# EasyEDA Pro project ProProject_Mini-Cube_2024-04-10.epro, board PCB3
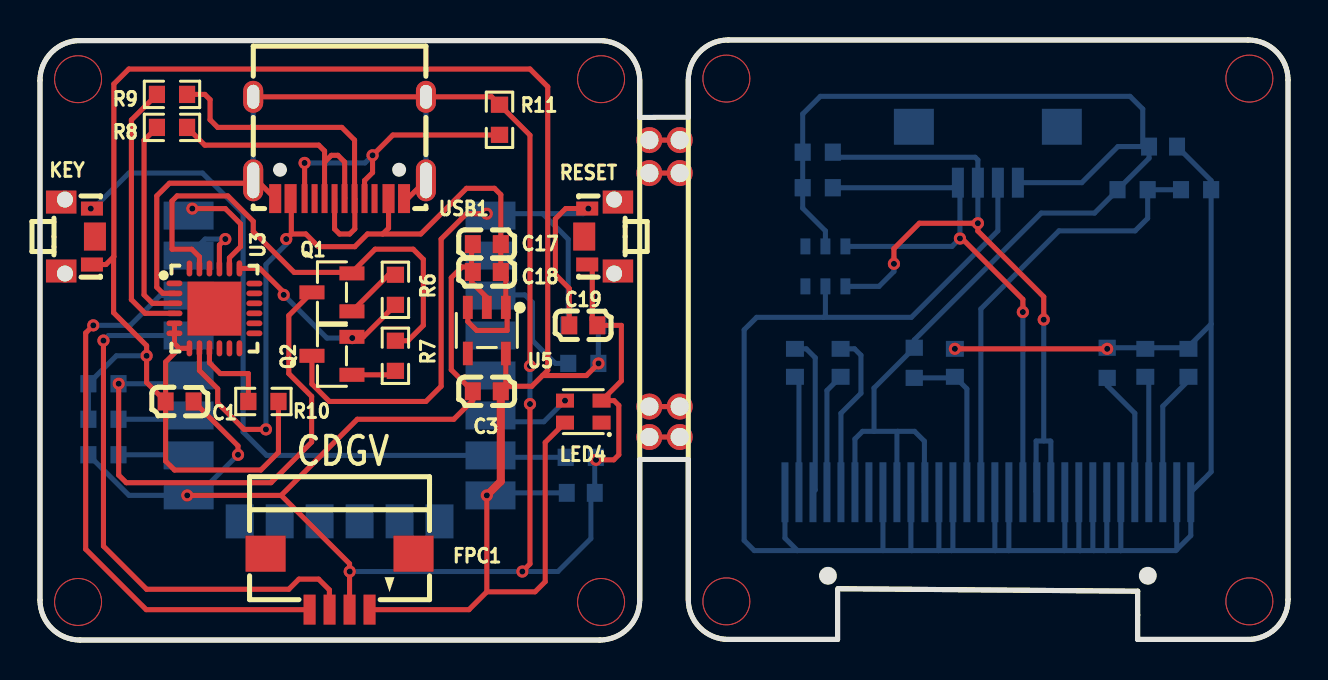
[diagram p1: board, top side]
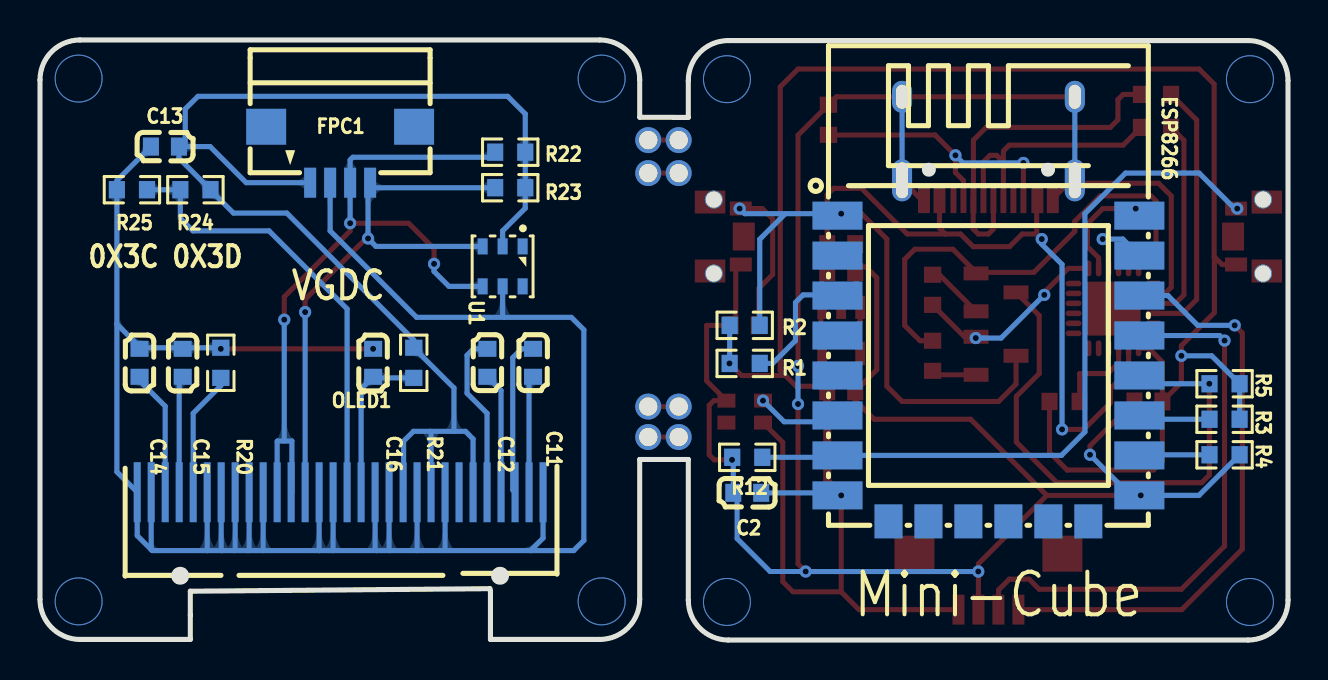
[diagram p2: board, bottom side, seen from below]

Outline 62.43 x 30.03 mm; copper layers: Top Layer, Bottom Layer. Coordinates in mm from the lower left corner of the outline.
Outline path: 0,28 0,2 arc(0.59,0.59) 2,0 28,0 arc(29.41,0.59) 30,2 30,9.04 32.43,9.04 32.43,2.03 arc(33.02,0.62) 34.43,0.03 39.9,0.03 39.9,2.44 39.92,2.57 54.91,2.44 54.91,0.03 60.43,0.03 arc(61.84,0.62) 62.43,2.03 62.43,28.03 arc(61.84,29.44) 60.43,30.03 34.43,30.03 arc(33.02,29.44) 32.43,28.03 32.43,26.16 30,26.15 30,28 arc(29.41,29.41) 28,30 2,30 arc(0.59,29.41) 0,28
Stack: Top Layer 0.035mm / Dielectric1 1.51mm FR4 er 4.5 / Bottom Layer 0.035mm

## Design rules (mm)
template: JLCPCB Capability(Two Layers Board)
spacing copperThickness1oz (default): track to track 0.102, other pairs 0.152 to 0.3
spacing copperThickness2oz: track to track 0.203, other pairs 0.152 to 0.3
track width copperThickness1oz (default): min 0.127, default 0.254, max 2.54
track width copperThickness2oz: min 0.203, default 0.254, max 2.54
differential pair differentialPair (default): width min 0.127, default 0.254, max 2.54; gap min 0.152, default 0.152
via viaSize (default): diameter min 0.5, default 0.61, max 10; hole min 0.3, default 0.305, max 6.3

## Placement (name value [footprint] x y rotation side)
C1  100nF  [C0603]  6.98 11.94 180 top
C2  100nF  [C0603]  27.05 7.37 180 bottom
C3  100nF  [C0603]  22.35 12.45 0 top
C11  100nF  [C0603]  37.76 13.87 270 bottom
C12  100nF  [C0603]  40.05 13.87 270 bottom
C13  100nF  [C0603]  56.18 24.7 0 bottom
C14  2.2UF  [C0603]  57.45 13.87 90 bottom
C15  4.7UF  [C0603]  55.29 13.87 90 bottom
C16  100nF  [C0603]  45.77 13.87 90 bottom
C17  100nF  [C0603]  22.35 19.81 0 top
C18  1UF  [C0603]  22.35 18.42 0 top
C19  100nF  [C0603]  27.18 15.75 0 top
ESP8266  2.4GHz  [WIFIM-SMD_ESP-12F-ESP8266MOD]  14.99 13.59 270 bottom
FPC1  -  [FFC-SMD_FFC10032-04SBB123W5M]  14.99 2.92 180 top
FPC1#2  -  [ffc-smd_ffc10032-04sbb123w5m]  47.42 24.29 0 bottom
KEY  GT-TC173C-H029-L1  [SW-SMD_GT-TC173A-H029-L1]  1.91 20.19 270 top
LED4  WS2812B-2020  [LED-SMD_4P-L2.0-W2.0-TL_WS2812B-2020]  27.18 11.43 180 top
NOREF  -  [Pad_e686]  30.48 10.16 0 top
NOREF#2  -  [Pad_e687]  30.48 11.68 0 top
NOREF#3  -  [Pad_e688]  32 11.68 0 top
NOREF#4  -  [Pad_e682]  32 23.37 0 top
NOREF#5  -  [Pad_e675]  32 25.02 0 top
NOREF#6  -  [Pad_e681]  30.48 23.37 0 top
NOREF#7  -  [Pad_e671]  30.48 25.02 0 top
NOREF#8  -  [Pad_e689]  32 10.16 0 top
OLED1  VG-2864KSWEG01  [oled_0.96-30p-p0.70-12864]  47.42 7.4 0 bottom
Q1  SS8050  [SOT-23-3_L2.9-W1.3-P1.90-LS2.4-BR]  14.61 17.4 0 top
Q2  SS8050  [SOT-23-3_L2.9-W1.3-P1.90-LS2.4-BR]  14.61 14.22 0 top
R1  10K  [R0603]  27.18 13.84 180 bottom
R2  10K  [R0603]  27.18 15.75 180 bottom
R3  10K  [R0603]  3.18 11.05 0 bottom
R4  10K  [R0603]  3.18 9.27 0 bottom
R5  10K  [R0603]  3.18 12.83 180 bottom
R6  1k  [R0603]  17.78 17.53 90 top
R7  1k  [R0603]  17.78 14.22 270 top
R8  220  [R0603]  6.6 25.65 180 top
R9  220  [R0603]  6.6 27.31 180 top
R10  4.7K  [R0603]  11.18 11.94 180 top
R11  5.1K  [R0603]  22.99 26.04 270 top
R12  10K  [R0603]  27.05 9.14 180 bottom
R20  910K  [R0603]  53.39 13.87 90 bottom
R21  4.7K  [R0603]  43.73 13.87 270 bottom
R22  10K  [R0603]  38.91 24.41 0 bottom
R23  10K  [R0603]  38.91 22.64 0 bottom
R24  10K  [R0603]  54.66 22.54 0 bottom
R25  10K  [R0603]  57.83 22.54 0 bottom
RESET  GT-TC173C-H029-L1  [SW-SMD_GT-TC173A-H029-L1]  28.07 20.19 90 top
U1  AHT20  [SENSOR-SMD_L3.0-W3.0-P1.00-BR]  39.29 18.7 90 bottom
U3  CP2104  [QFN-24_L4.0-W4.0-P0.50-BL-EP2.7]  8.73 16.6 270 top
U5  TPRT9013-33GB  [SOT-23-5_L3.0-W1.7-P0.95-LS2.8-BL]  22.35 15.49 180 top
USB1  TYPEC-304-BCP16  [USB-C-SMD_TYPEC-304-BCP16]  14.99 24.64 180 top

## Footprints (pads in the part's own frame, mm; a bottom-side part is the same pattern mirrored in y, then rotated)
C0603
  rect 0.8x0.9 smd: 1(-0.7,0) 2(0.7,0)
FFC-SMD_FFC10032-04SBB123W5M
  rect 0.6x1.5 smd: 1(-1.5,1.4) 2(-0.5,1.4) 3(0.5,1.4) 4(1.5,1.4)
  rect 2x1.8 smd: 5(3.7,-1.4) 6(-3.7,-1.4)
ffc-smd_ffc10032-04sbb123w5m
  rect 0.6x1.5 smd: 1(1.5,1.4) 2(0.5,1.4) 3(-0.5,1.4) 4(-1.5,1.4)
  rect 2x1.8 smd: 5(-3.7,-1.4) 6(3.7,-1.4)
LED-SMD_4P-L2.0-W2.0-TL_WS2812B-2020
  rect 0.9x0.7 smd: 1(-0.915,0.55) 2(-0.915,-0.55) 3(0.915,-0.55) 4(0.915,0.55)
oled_0.96-30p-p0.70-12864
  rect 0.35x3 smd: 1(-10.15,0.003) 2(-9.45,0.001) 3(-8.75,0.001) 4(-8.05,0.001) 5(-7.35,0.001) 6(-6.65,0.001) 7(-5.95,0.001) 8(-5.25,0.001) 9(-4.55,0.001) 10(-3.85,0.001) 11(-3.15,0.001) 12(-2.45,0.001) 13(-1.75,0.001) 14(-1.05,0.001) 15(-0.35,0.001) 16(0.35,0.001) 17(1.05,0.001) 18(1.75,0.001) 19(2.45,0.001) 20(3.15,0.001) 21(3.85,0.001) 22(4.55,0.001) 23(5.25,0.001) 24(5.95,0.001) 25(6.65,0.001) 26(7.35,0.001) 27(8.05,0.001) 28(8.75,-0.002) 29(9.45,-0.003) 30(10.15,-0.003)
Pad_e671
  round 1.3 hole 0.914: 31(0,0)
Pad_e675
  round 1.3 hole 0.914: 31(0,0)
Pad_e681
  round 1.3 hole 0.914: 31(0,0)
Pad_e682
  round 1.3 hole 0.914: 31(0,0)
Pad_e686
  round 1.3 hole 0.914: 31(0,0)
Pad_e687
  round 1.3 hole 0.914: 31(0,0)
Pad_e688
  round 1.3 hole 0.914: 31(0,0)
Pad_e689
  round 1.3 hole 0.914: 31(0,0)
QFN-24_L4.0-W4.0-P0.50-BL-EP2.7
  oval 0.28x0.8 smd: 1(-1.25,-2) 2(-0.75,-2) 3(-0.25,-2) 4(0.25,-2) 5(0.75,-2) 6(1.25,-2) 13(1.25,2) 14(0.75,2) 15(0.25,2) 16(-0.25,2) 17(-0.75,2) 18(-1.242,2)
  oval 0.8x0.28 smd: 7(2,-1.25) 8(2,-0.75) 9(2,-0.25) 10(2,0.25) 11(2,0.75) 12(2,1.25) 19(-2,1.25) 20(-2,0.75) 21(-2,0.25) 22(-2,-0.25) 23(-2,-0.75) 24(-2,-1.25)
  rect 2.7x2.7 smd: 25(0.013,0)
R0603
  rect 0.806x0.864 smd: 1(-0.753,0) 2(0.753,0)
SENSOR-SMD_L3.0-W3.0-P1.00-BR
  rect 0.8x0.5 smd: 1(1,-1) 2(1,0) 3(1,1) 4(-1,1) 5(-1,0) 6(-1,-1)
SOT-23-3_L2.9-W1.3-P1.90-LS2.4-BR
  rect 1.25x0.7 smd: 1(1,-0.95) 2(1,0.95) 3(-1,0)
SOT-23-5_L3.0-W1.7-P0.95-LS2.8-BL
  rect 0.49x1.157 smd: 1(-0.95,-1.153) 2(0,-1.153) 3(0.95,-1.153)
  rect 0.49x1.175 smd: 4(0.95,1.153) 5(-0.95,1.153)
SW-SMD_GT-TC173A-H029-L1
  rect 0.7x1.1 smd: 1(-1.4,0.694) 2(1.4,0.694)
  rect 1.4x1.1 smd: 3(0,0.844)
  round 0.9 hole 0.8: 4(-1.85,-0.656) 4(1.85,-0.656)
  rect 1.15x1.524 smd: 4(-1.725,-0.844) 4(1.725,-0.844)
USB-C-SMD_TYPEC-304-BCP16
  oval 1x2.1 hole 0.6x1.8: 13(-4.32,1.633) 14(4.32,1.633)
  oval 1x1.6 hole 0.6x1.2: 15(-4.32,-2.547) 16(4.32,-2.547)
  rect 0.6x1.45 smd: A1B12(-3.225,2.547) A4B9(-2.45,2.547) B1A12(3.22,2.547) B4A9(2.45,2.547)
  rect 0.3x1.45 smd: A5(-1.25,2.547) A6(-0.25,2.547) A7(0.25,2.547) A8(1.25,2.547) B5(1.75,2.547) B6(0.75,2.547) B7(-0.75,2.547) B8(-1.75,2.547)
WIFIM-SMD_ESP-12F-ESP8266MOD
  rect 1.4x2.5 smd: 1(-7.651,-7.551) 2(-5.651,-7.551) 3(-3.651,-7.551) 4(-1.651,-7.551) 5(0.349,-7.551) 6(2.349,-7.551) 7(4.349,-7.551) 8(6.349,-7.551) 9(6.349,7.548) 10(4.349,7.55) 11(2.349,7.551) 12(0.349,7.551) 13(-1.651,7.55) 14(-3.651,7.551) 15(-5.651,7.551) 16(-7.651,7.551)
  rect 1.7x1.4 smd: 17(7.651,-5) 18(7.649,-3.002) 19(7.649,-1.004) 20(7.649,0.998) 21(7.649,2.997) 22(7.651,4.997)

## Nets
+5V: C17.2 C18.2 U3.8 U5.1 U5.3 USB1.A4B9 USB1.B4A9
GND: C1.1 C2.1 C3.1 C13.2 C14.2 C15.2 C16.2 C17.1 C18.1 C19.2 ESP8266.9 FPC1.2 FPC1#2.2 LED4.2 NOREF.31 NOREF#2.31 NOREF#3.31 NOREF#4.31 NOREF#5.31 NOREF#6.31 NOREF#7.31 NOREF#8.31 OLED1.1 OLED1.8 OLED1.10 OLED1.12 OLED1.13 OLED1.16 OLED1.17 OLED1.21 OLED1.22 OLED1.23 OLED1.24 OLED1.25 OLED1.29 OLED1.30 R4.1 R11.1 R12.1 R20.2 R25.2 RESET.1 U1.5 U3.2 U5.2 USB1.13 USB1.14 USB1.15 USB1.16 USB1.A1B12 USB1.B1A12
VCC: C1.2 C2.2 C3.2 C13.1 ESP8266.8 FPC1.1 FPC1#2.1 KEY.2 LED4.4 OLED1.6 OLED1.9 OLED1.11 R1.1 R2.1 R3.1 R5.2 R10.1 R21.1 R22.1 R23.1 R24.1 U1.2 U3.5 U3.6 U3.7 U5.5
VCCOMH: C15.1 OLED1.27
DN: R9.1 USB1.A7 USB1.B7
DP: R8.1 USB1.A6 USB1.B6
DTR: Q1.2 R7.1 U3.23
ESP_RST: C19.1 ESP8266.1 Q2.3 R2.2 RESET.2
ESP_RX: ESP8266.15 U3.21
ESP_TX: ESP8266.16 U3.20
GPIO0: ESP8266.12 Q1.3 R5.1
IREF: OLED1.26 R20.1
KEY: ESP8266.7 KEY.1 R12.2
OLED_VCC: C14.1 OLED1.28
RTS: Q2.2 R6.1 U3.19
SA0: OLED1.15 R24.2 R25.1
SCL: ESP8266.14 FPC1.4 FPC1#2.4 OLED1.18 R23.2 U1.3
SDA: ESP8266.13 FPC1.3 FPC1#2.3 OLED1.19 OLED1.20 R22.2 U1.4
WS2812B: ESP8266.6 LED4.3
$1N382: ESP8266.10 R4.2
$1N385: ESP8266.11 R3.2
$1N388: ESP8266.3 R1.2
$1N424: C11.2 OLED1.2
$1N425: C12.2 OLED1.4
$1N426: C11.1 OLED1.3
$1N427: C12.1 OLED1.5
$1N447: C16.1 OLED1.14 R21.2
$1N764: Q2.1 R7.2
$1N765: Q1.1 R6.2
$1N803: R8.2 U3.3
$1N809: R9.2 U3.4
$1N935: R10.2 U3.9
$1N1200: R11.2 USB1.A5 USB1.B5

Pads without a net: ESP8266 2 4 5 17 18 19 20 21 22; FPC1 5 6; FPC1#2 5 6; KEY 3 4; LED4 1; OLED1 7; RESET 3 4; U1 1 6; U3 1 10 11 12 13 14 15 16 17 18 22 24 25; U5 4; USB1 A8 B8

## Via types
v1: diameter 2.4, hole 2.3, Top Layer to Bottom Layer, 8 vias
v2: diameter 0.61, hole 0.305, Top Layer to Bottom Layer, 32 vias

## Routing (per net, layer and track width the routed paths; a pad name or vN(x,y) marks a point on that pad's centre or on a via; arc(x,y) is an arc through that point)
+5V: length 41.9
  Top Layer w0.254: 17.15,20.32 16.38,20.32 15.75,19.69 13.93,19.69 13.3,20.32 12.57,20.32 ; 17.15,20.32 19.05,20.32 21.34,22.61 22.73,22.61 23.05,22.29 C17.2 C18.2 23.3,18.17 U5.1 23.37,16.58 23.37,15.49 21.84,15.49 21.4,15.94 U5.3 ; 17.15,20.32 17.44,20.61 USB1.A4B9 ; v2(11.3,10.54) 10.21,10.54 8.89,11.86 8.89,12.57 7.98,13.49 U3.8 ; 12.57,20.32 v2(12.32,20.07) ; 12.57,20.32 12.57,22.05 USB1.B4A9
  Bottom Layer w0.254: v2(11.3,10.54) 11.3,18.8 12.32,19.81 v2(12.32,20.07)
GND: length 267.2
  Top Layer w0.25: USB1.16 USB1.15 ; v2(24.51,13.72) 24.51,25.26 R11.1 ; v2(9.91,9.27) 9.91,9.72 C1.1 ; v2(27.81,9.02) 28.7,9.02 28.96,9.27 28.96,11.74 28.72,11.98 28.09,11.98 29.08,12.97 29.08,15.75 C19.2 ; v2(24.51,11.81) 24.51,3.81
  Top Layer w0.254: C19.2 27.63,16 27.63,18.79 ; 21.59,18.65 21.59,19.75 C17.1 ; 21.59,18.65 21.57,18.67 21.11,18.67 20.57,18.13 20.57,13.52 C3.1 21.65,12 20.7,11.05 15.88,11.05 12.06,7.24 ; 21.59,18.65 21.59,17.91 22.35,17.15 U5.2 ; NOREF#2.31 NOREF#3.31 ; NOREF#6.31 NOREF#4.31 ; 10.85,23.01 USB1.14 ; 10.85,23.01 USB1.B1A12 ; 10.85,23.01 10.71,22.86 6.48,22.86 5.84,22.23 5.84,17.66 6.15,17.35 U3.2 ; 15.49,3.44 15.49,3.82 12.06,7.24 ; 15.49,3.44 FPC1.2 ; 15.49,3.44 v2(15.49,3.43) ; NOREF#7.31 NOREF#5.31 ; USB1.13 18.39,22.09 USB1.A1B12 ; 24.51,3.81 v2(24.13,3.43) ; 12.06,7.24 v2(7.37,7.24) ; USB1.15 22.59,27.19 R11.1 ; v2(45.77,14.57) v2(53.39,14.57) ; NOREF#8.31 NOREF.31
  Bottom Layer w0.25: v2(24.13,3.43) 25.91,3.43 27.56,5.08 27.56,7.17 C2.1 27.75,9.09 ; 27.75,9.09 27.81,9.03 v2(27.81,9.02) ; 27.75,9.09 R12.1 ; v2(9.91,9.27) 7.87,7.24 ESP8266.9 ; v2(24.51,13.72) v2(24.51,11.81)
  Bottom Layer w0.254: 57.4,14.63 R20.2 v2(53.39,14.57) ; 57.4,14.63 C14.2 ; 57.4,14.63 58.58,15.81 ; 39.2,16.15 39.29,16.24 U1.5 ; 39.2,16.15 35.85,16.15 35.22,15.52 35.22,4.98 35.73,4.48 37.89,4.48 ; 39.2,16.15 43.59,16.15 47.92,20.48 FPC1#2.2 ; 52.02,4.48 51.97,4.53 51.97,7.4 ; 52.02,4.48 51.23,4.48 ; 52.02,4.48 52.71,4.48 ; 52.71,4.48 52.67,4.52 52.67,7.4 ; 52.71,4.48 53.33,4.48 ; 51.23,4.48 51.27,4.51 51.27,7.4 ; 51.23,4.48 48.45,4.48 ; 44.97,7.4 44.97,4.5 44.95,4.48 ; 44.95,4.48 43.61,4.48 ; 44.95,4.48 45.6,4.48 ; USB1.14 USB1.16 ; 58.58,15.81 58.58,8.42 OLED1.30 57.57,5.23 56.87,4.53 ; 58.58,15.81 R25.2 58.58,22.99 C13.2 ; v2(24.13,3.43) v2(15.49,3.43) ; 54.07,7.4 54.07,4.48 54.06,4.48 ; 45.6,4.48 47.79,4.48 ; 45.6,4.48 45.67,4.55 45.67,7.4 ; 47.79,4.48 48.45,4.48 ; 47.79,4.48 47.77,4.5 47.77,7.4 ; 53.37,7.4 53.37,4.52 53.33,4.48 ; 37.89,4.48 43.61,4.48 ; 37.89,4.48 37.27,5.1 OLED1.1 ; 43.61,4.48 43.57,4.52 43.57,7.4 ; 53.33,4.48 54.06,4.48 ; 48.45,4.48 48.47,4.49 48.47,7.4 ; OLED1.29 56.87,4.53 ; 56.87,4.53 56.81,4.48 54.06,4.48 ; 42.17,7.4 42.17,4.48 ; USB1.15 USB1.13 ; R4.1 4.45,7.24 v2(7.37,7.24) ESP8266.9
VCC: length 185.8
  Top Layer w0.25: 22.35,2.41 24.77,2.41 25.27,2.92 25.27,9.89 LED4.4
  Top Layer w0.254: v2(22.35,7.24) 22.35,2.41 21.46,1.52 FPC1.1 ; 3.68,19.18 3.68,16.38 5.33,14.73 v2(5.33,14.22) 5.33,12.89 6.29,11.94 ; 3.68,19.18 3.7,19.19 3.7,27.83 4.45,28.58 24.51,28.58 25.4,27.69 25.4,13.5 25.14,13.24 ; 3.68,19.18 3.3,18.79 2.47,18.79 ; U5.5 23.3,12.7 ; 23.3,12.7 C3.2 ; 23.3,12.7 23.31,12.7 24.6,12.7 25.14,13.24 ; 6.29,11.94 6.29,13.92 6.97,14.6 ; 6.29,11.94 6.29,8.95 6.73,8.51 11.05,8.51 11.93,9.39 R10.1 ; v2(27.94,13.84) 27.33,13.24 25.14,13.24 ; 6.97,14.6 U3.7 ; 6.97,14.6 6.73,14.84 U3.6 U3.5
  Top Layer w0.4: v2(22.35,7.24) 23.05,7.94 C3.2
  Bottom Layer w0.254: v2(22.35,7.24) ESP8266.8 22.66,7.37 26.35,7.37 ; 44.27,7.4 44.24,7.42 44.24,9.95 43.75,10.44 42.9,10.44 ; 41.72,10.44 42.9,10.44 ; 41.72,10.44 41.72,12.61 R21.1 43.73,15.02 50.08,21.37 52.75,21.37 53.9,22.52 R24.1 55.48,24.11 C13.1 55.25,24.7 ; 41.72,10.44 41.15,10.44 40.77,10.06 40.77,7.4 ; 42.9,10.44 42.87,10.41 42.87,7.4 ; 55.25,24.7 55.16,24.78 55.16,26.57 54.53,27.21 39.03,27.21 38.15,26.33 R22.1 R23.1 38.15,21.61 39.29,20.48 U1.2 ; 55.25,24.7 53.92,24.7 52.11,22.89 FPC1#2.1 ; R3.1 R5.2 3.82,14.22 v2(5.33,14.22) ; R2.1 R1.1 v2(27.94,13.84)
VCCOMH: length 5.8
  Bottom Layer w0.254: C15.1 55.47,13 55.47,7.4
(no net):
  vias: v1(1.91,28.07) v1(1.91,1.91) v1(28.07,28.07) v1(28.07,1.91) v1(34.34,28.1) v1(34.34,1.94) v1(60.5,28.1) v1(60.5,1.94)
DN: length 17.1
  Top Layer w0.254: USB1.A7 14.74,20.57 14.99,20.32 15.49,20.32 15.75,20.57 15.75,22.08 USB1.B7 15.74,25.02 15.1,25.65 8.89,25.65 8.51,26.04 8.51,27.04 8.25,27.31 R9.1
DP: length 12.9
  Top Layer w0.254: 14.24,23.92 14.58,24.26 14.9,24.26 15.24,23.92 15.24,22.09 USB1.A6 ; 14.24,23.92 USB1.B6 ; 14.24,23.92 14.24,24.47 13.94,24.77 8.25,24.77 R8.1
DTR: length 24.8
  Top Layer w0.254: 15.61,18.4 16.76,19.56 18.67,19.56 19.18,19.05 19.18,15.75 18.41,14.98 R7.1 ; 15.61,18.4 Q1.2 ; 15.61,18.4 12.72,18.4 10.67,20.45 10.67,20.95 9.4,22.23 6.86,22.23 6.6,21.97 6.6,19.56 7.59,19.56 7.98,19.18 U3.23
ESP_RST: length 37.8
  Top Layer w0.254: v2(27.43,21.59) 27.44,21.59 ; 27.44,21.59 27.63,21.59 ; 27.44,21.59 26.3,21.59 25.78,21.08 25.78,18.29 26.48,17.59 C19.1 ; v2(22.35,21.34) 21.34,21.34 20.07,20.07 20.07,12.7 19.3,11.94 14.48,11.94 13.61,12.81 Q2.3
  Bottom Layer w0.254: v2(27.43,21.59) 27.18,21.34 25.15,21.34 ; 25.15,21.34 26.42,20.06 R2.2 ; 25.15,21.34 22.44,21.34 ; 22.44,21.34 ESP8266.1 ; 22.44,21.34 v2(22.35,21.34)
ESP_RX: length 3.8
  Top Layer w0.254: v2(9.27,20.07) 8.98,19.77 U3.21
  Bottom Layer w0.254: ESP8266.15 8.26,20.07 v2(9.27,20.07)
ESP_TX: length 5.6
  Top Layer w0.254: U3.20 9.48,19.13 10.03,19.69 10.03,20.83 9.27,21.59 v2(7.62,21.59)
  Bottom Layer w0.254: ESP8266.16 7.62,21.42 v2(7.62,21.59)
GPIO0: length 27.3
  Top Layer w0.254: v2(3.94,12.83) 3.94,8.26 4.32,7.87 11.56,7.87 13.59,9.91 13.59,12.19 12.45,13.34 12.45,16.24 Q1.3
  Bottom Layer w0.254: R5.1 v2(3.94,12.83) 7.02,12.83 ESP8266.12
IREF: length 6.3
  Bottom Layer w0.254: R20.1 53.39,12.73 54.77,11.35 54.77,7.4
KEY: length 36.9
  Top Layer w0.254: v2(2.54,21.59) 2.48,21.59 2.47,21.59
  Bottom Layer w0.25: ESP8266.7 22.63,9.14 R12.2
  Bottom Layer w0.254: ESP8266.7 11.33,9.24 10.16,10.41 10.16,21.34 8.13,23.37 4.45,23.37 2.67,21.59 v2(2.54,21.59)
OLED_VCC: length 6.3
  Bottom Layer w0.254: C14.1 57.45,12.98 56.17,11.7 OLED1.28
RTS: length 10.1
  Top Layer w0.254: U3.19 10.99,18.6 12.19,17.4 v2(12.19,17.27) ; v2(15.62,15.11) 15.62,15.16 Q2.2 16.18,15.17 R6.1
  Bottom Layer w0.254: v2(15.62,15.11) 14.35,15.11 v2(12.19,17.27)
SA0: length 22.5
  Bottom Layer w0.254: R25.1 R24.2 55.41,21.1 54.78,20.48 50.97,20.48 47.07,16.57 47.07,7.4
SCL: length 58.3
  Top Layer w0.254: v2(49.17,16.41) 49.17,17.05 46.12,20.1 v2(46.02,20.1) ; v2(2.67,15.75) 2.29,15.37 2.29,4.55 5.31,1.52 FPC1.4
  Bottom Layer w0.254: R23.2 45.66,22.64 FPC1#2.4 46.02,22.78 v2(46.02,20.1) 45.62,19.7 U1.3 ; 49.17,7.4 v2(49.17,16.41) ; ESP8266.14 6.01,17.24 4.52,15.75 v2(2.67,15.75)
SDA: length 65.6
  Top Layer w0.254: v2(42.72,18.83) 42.72,19.59 43.99,20.86 v2(46.92,20.86) 46.92,20.47 50.21,17.18 v2(50.21,16.03) ; FPC1.3 14.48,1.53 14.48,2.51 13.94,3.05 12.95,3.05 12.45,2.54 5.33,2.54 3.18,4.7 v2(3.18,14.99)
  Bottom Layer w0.254: v2(3.18,14.99) 3.43,15.24 ESP8266.13 ; R22.2 39.91,24.16 46.78,24.16 46.92,24.03 FPC1#2.3 v2(46.92,20.86) ; U1.4 41.97,17.7 42.72,18.45 v2(42.72,18.83) ; 50.57,7.4 50.57,9.94 50.54,9.96 49.83,9.96 49.83,7.43 49.87,7.4 ; v2(50.21,16.03) 50.21,9.96
WS2812B: length 4.3
  Bottom Layer w0.25: ESP8266.6 22.86,10.92 25.21,10.92 v2(26.26,11.98)
$1N382: length 3.5
  Bottom Layer w0.254: ESP8266.10 7.4,9.27 R4.2
$1N385: length 3.6
  Bottom Layer w0.254: R3.2 7.24,11.05 ESP8266.11
$1N388: length 6.4
  Bottom Layer w0.254: R1.2 25.78,13.84 24.64,14.99 24.64,16.89 24.26,17.27 22.57,17.27 ESP8266.3
$1N424: length 5.9
  Bottom Layer w0.254: C11.2 37.97,12.97 37.97,7.4
$1N425: length 6.1
  Bottom Layer w0.254: 39.37,7.4 39.37,12.49 C12.2
$1N426: length 8
  Bottom Layer w0.254: C11.1 38.33,14.57 38.78,14.13 38.78,7.51 38.67,7.4
$1N427: length 8.4
  Bottom Layer w0.254: C12.1 40.75,14.57 41.07,14.25 41.07,12.35 40.07,11.35 40.07,7.4
$1N447: length 8.1
  Bottom Layer w0.254: 46.37,7.4 46.37,12.57 C16.1 45.71,13.12 R21.2
$1N764: length 2.3
  Top Layer w0.254: R7.2 17.58,13.27 Q2.1
$1N765: length 2.9
  Top Layer w0.254: Q1.1 17.44,18.28 R6.2
$1N803: length 10.3
  Top Layer w0.254: R8.2 5.21,25.01 5.21,17.27 5.63,16.85 U3.3
$1N809: length 13.2
  Top Layer w0.254: R9.2 4.57,26.03 4.57,17.04 5.26,16.35 U3.4
$1N935: length 4.3
  Top Layer w0.254: U3.9 8.48,13.88 9.02,13.34 10.42,13.34 R10.2
$1N1200: length 14.5
  Top Layer w0.254: R11.2 22.98,25.27 17.65,25.27 v2(16.64,24.26) 16.64,23.4 16.24,22.99 USB1.A5 ; USB1.B5 v2(13.24,23.88)
  Bottom Layer w0.254: v2(13.24,23.88) 16.26,23.88 v2(16.64,24.26)

## Copper pours and planes (outline as drawn; the poured copper is in the pictures)
GND on Top Layer: 9.91,34.8 10.54,34.16 7.75,31.37 6.98,31.37 6.98,20.66 22.98,20.66 23.05,20.59 23.05,35.24 23.11,35.31 68.2,35.31 69.34,36.45 69.34,-11.43 67.94,-12.83 -14.35,-12.83 -18.41,-8.76 -18.41,33.66 -17.27,34.8
GND on Bottom Layer: 9.84,34.67 10.48,34.04 7.68,31.24 6.92,31.24 6.92,20.53 22.91,20.53 22.99,20.46 22.99,35.12 23.05,35.18 68.14,35.18 69.28,36.32 69.28,-11.56 67.88,-12.95 -14.41,-12.95 -18.48,-8.89 -18.48,33.53 -17.34,34.67

Small or netless copper shapes (teardrops, artwork), in the pictures only: 8 on Top Layer, 65 on Bottom Layer

## Text on the board
Bottom Silkscreen Layer: 0X3C | 0X3D | VGDC | Mini-Cube
Top Silkscreen Layer: CDGV
